# EAGLE design C64_Keyb-Test-ext (EAGLE 9.5.2)
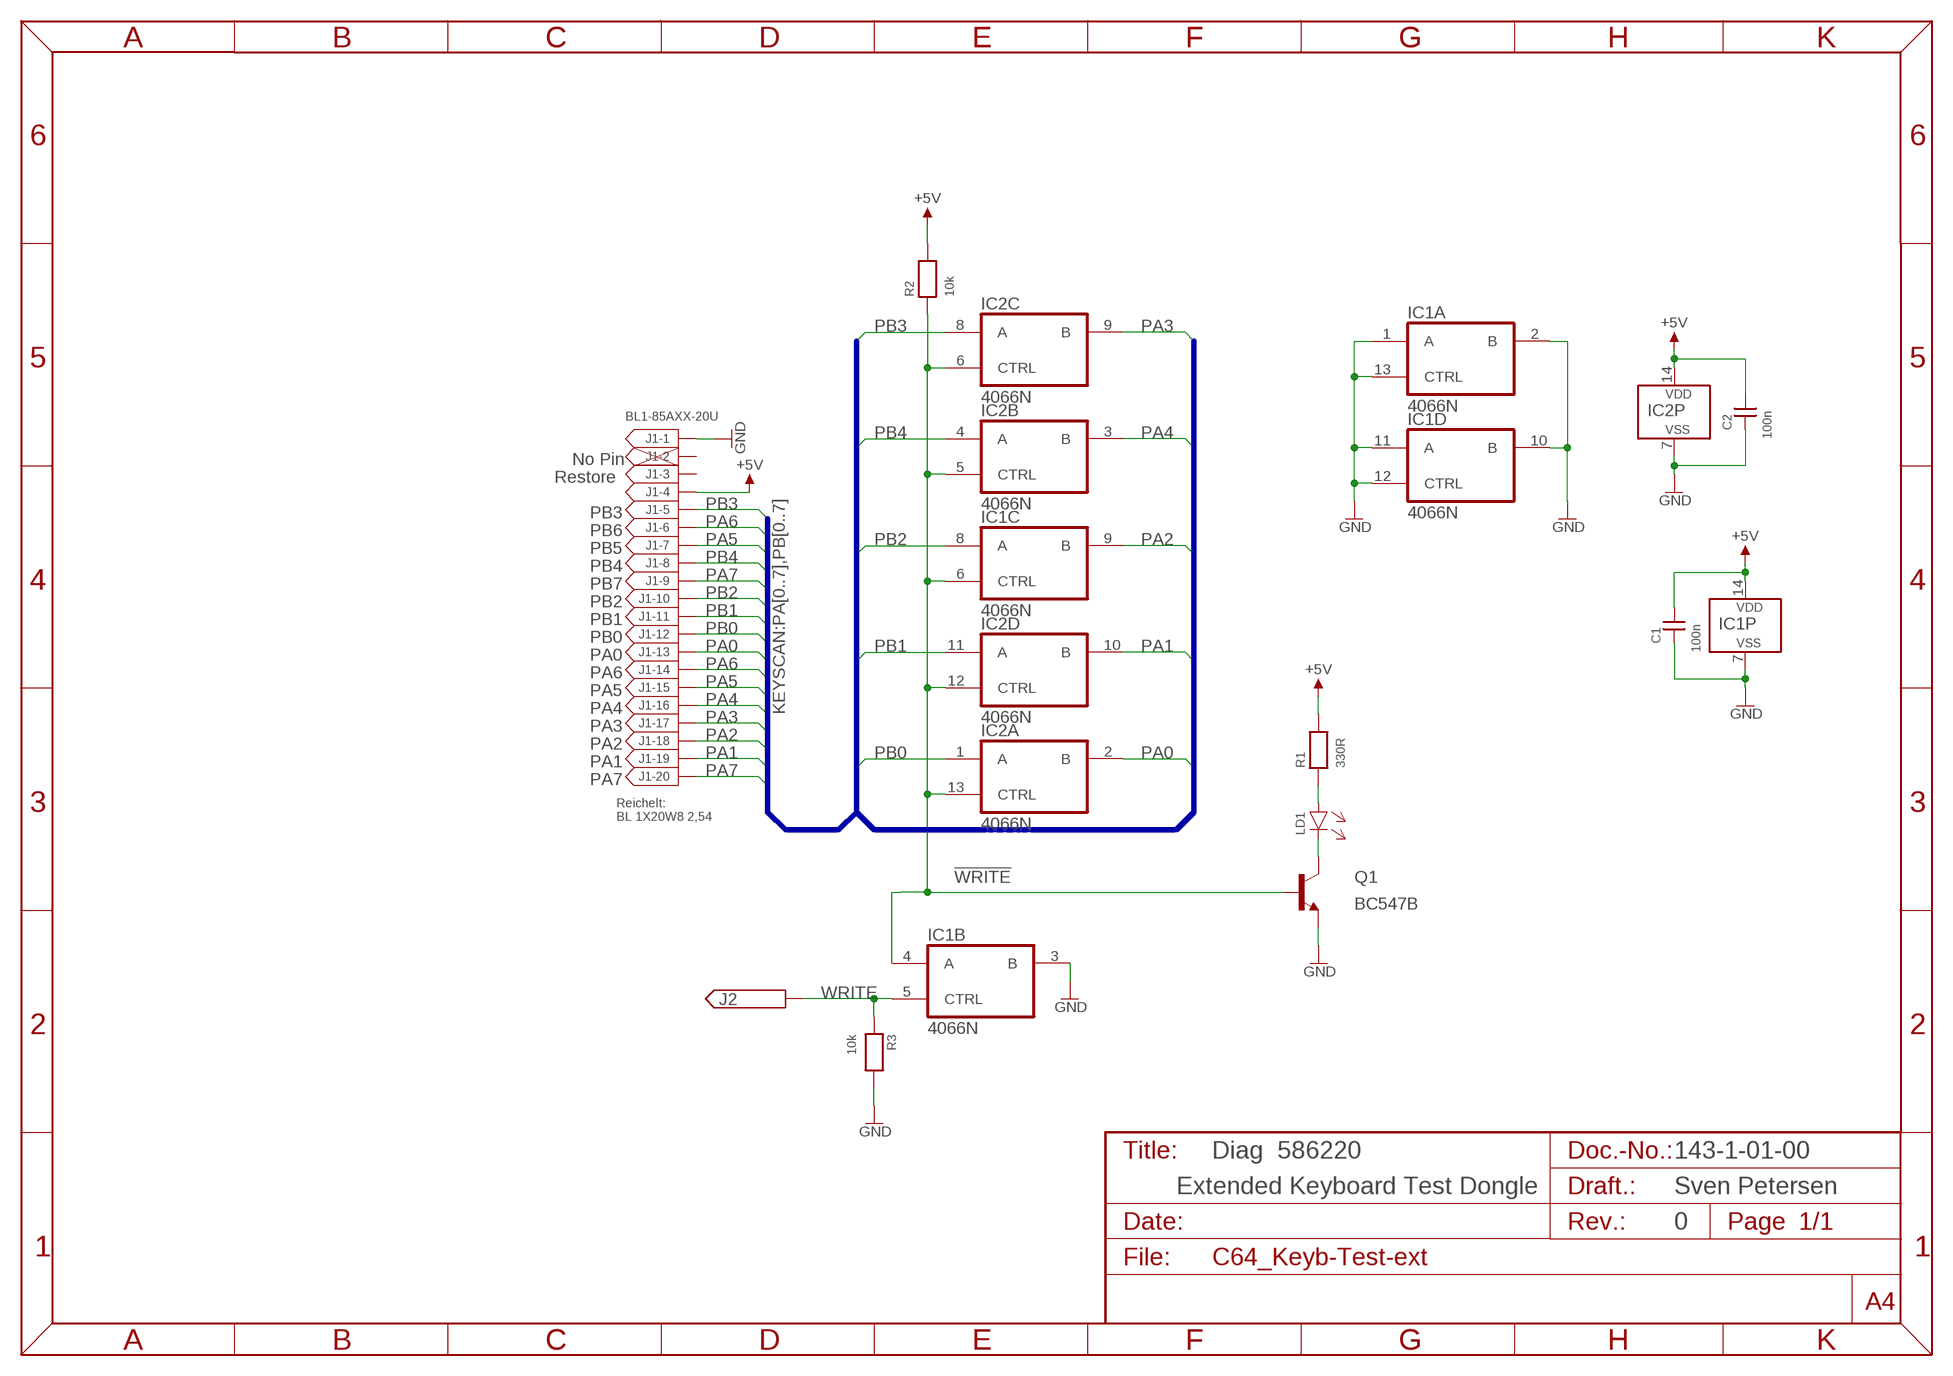
[diagram p0: schematic, sheet 1]

## Parts
C1  100n  CAP02  [C-5]
C2  100n  CAP02  [C-5]
IC1  4066N  [DIL14]
IC2  4066N  [DIL14]
J1  BL1-85AXX-20U  [BL1-85AXX-20U]
J2  PINHD-1X1  [1X01]
LD1  3MM  [3MM]
Q1  BC547B  [TO92]
R1  330R  RES04  [R-10]
R2  10k  RES04  [R-10]
R3  10k  RES04  [R-10]

## Nets
!WRITE: IC1.4(B:A) IC1.6(C:CTRL) IC2.5(B:CTRL) IC2.6(C:CTRL) IC2.12(D:CTRL) IC2.13(A:CTRL) Q1.2(B) R2.1
+5V: C1.2 C2.2 IC1.14(P:VDD) IC2.14(P:VDD) J1.4 R1.2 R2.2
GND: C1.1 C2.1 IC1.1(A:A) IC1.2(A:B) IC1.3(B:B) IC1.7(P:VSS) IC1.10(D:B) IC1.11(D:A) IC1.12(D:CTRL) IC1.13(A:CTRL) IC2.7(P:VSS) J1.1 Q1.1(E) R3.2
N$1: LD1.A R1.1
N$2: LD1.C(K) Q1.3(C)
PA0: IC2.2(A:B) J1.13
PA1: IC2.10(D:B) J1.19
PA2: IC1.9(C:B) J1.18
PA3: IC2.9(C:B) J1.17
PA4: IC2.3(B:B) J1.16
PA5: J1.7 J1.15
PA6: J1.6 J1.14
PA7: J1.9 J1.20
PB0: IC2.1(A:A) J1.12
PB1: IC2.11(D:A) J1.11
PB2: IC1.8(C:A) J1.10
PB3: IC2.8(C:A) J1.5
PB4: IC2.4(B:A) J1.8
WRITE: IC1.5(B:CTRL) J2.1 R3.1
Unconnected: J1.2 J1.3

## Buses
KEYSCAN:PA[0..7],PB[0..7]

## Notes on the sheet
- No Pin
- Restore
- PB3
- PB6
- PB5
- PB4
- PB7
- PB2
- PB1
- PB0
- PA0
- PA6
- PA5
- PA4
- PA3
- PA2
- PA1
- PA7
- Reichelt:
  BL 1X20W8 2,54
- Diag  586220 | 143-1-01-00
- Extended Keyboard Test Dongle | Sven Petersen
- 0

## Library data of the parts
C1 C2 = DISCRETE:CAP02
IC1 IC2 = 40xx:4066: Quad bilateral ANALOG SWITCH
J1 = MPE_Garry:BL1-85AXX-20U
J2 = PINHEAD:PINHD-1X1
LD1 = LED:3MM
Q1 = Transistoren:BC547*: NPN Transistor
R1-R3 = DISCRETE:RES04

## Board
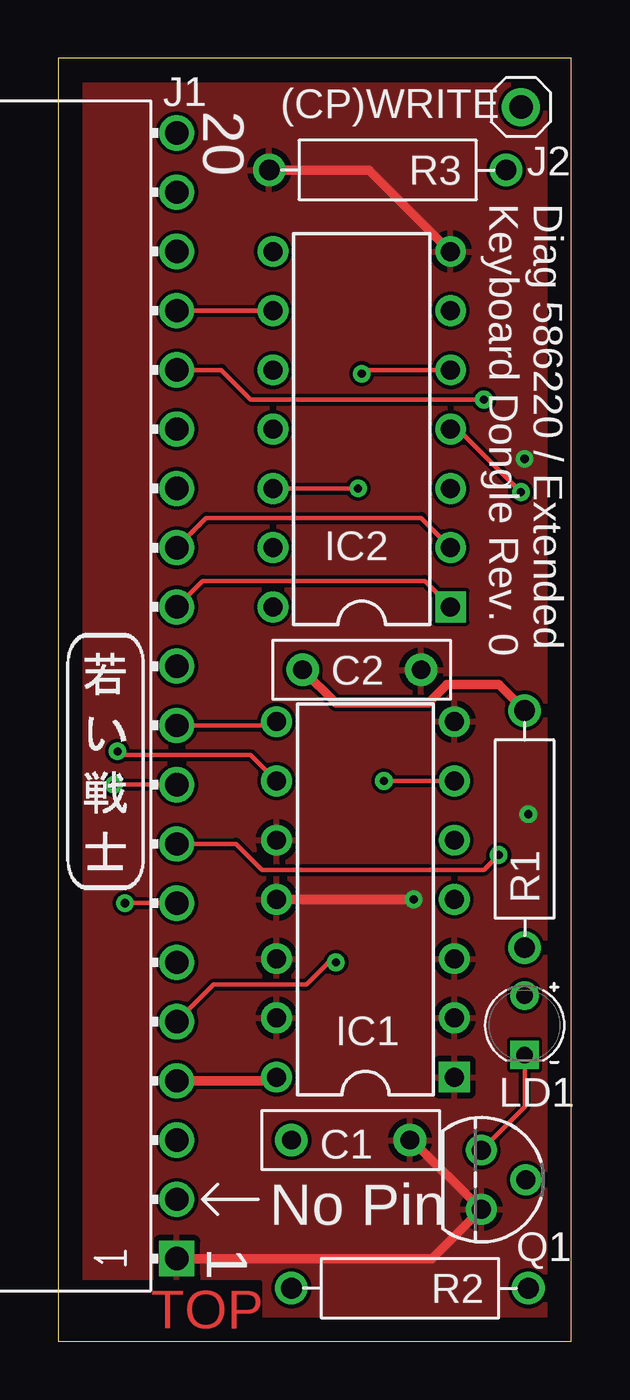
[diagram p1: board, top side]
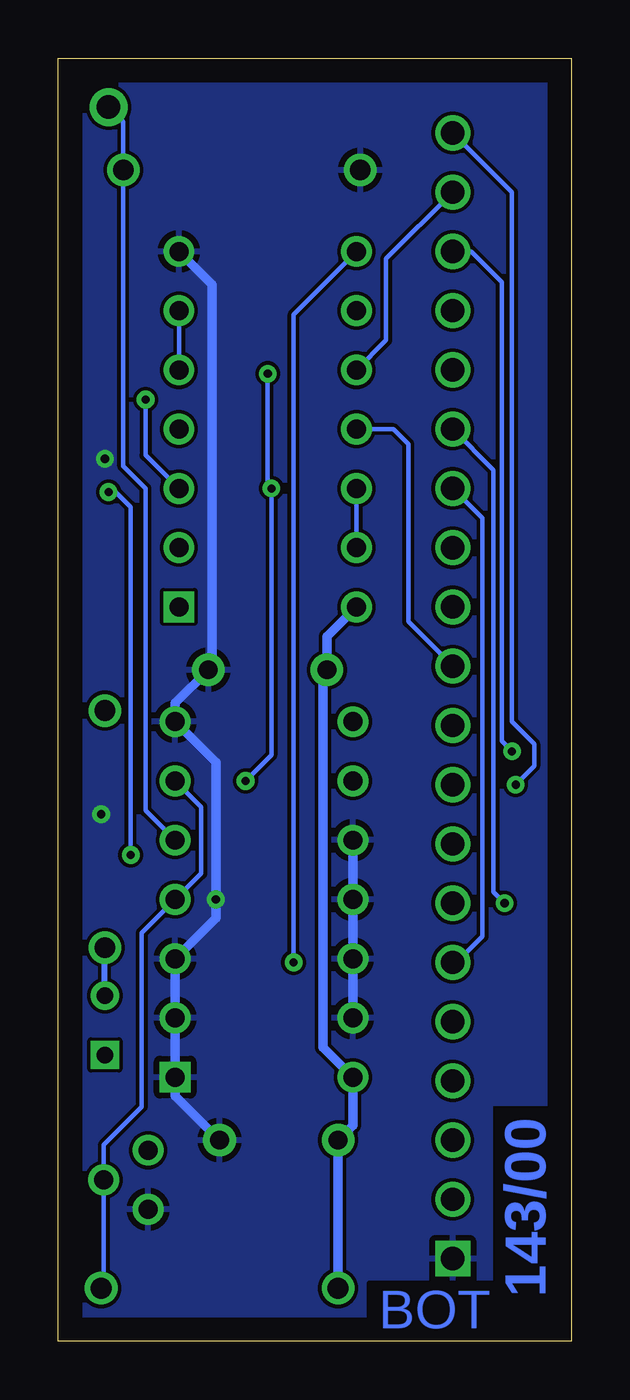
[diagram p2: board, bottom side, seen from below]

Size 22 x 55 mm. Coordinates in mm from the lower left corner, seen from the top.
Outline: 0,0 22,0 22,55 0,55 0,0
Copper layers (1*16): Top 0.035mm / dielectric 1.5mm / Bottom 0.035mm
Design rules "default *": minimum track width 6mil, minimum drill 0.35mm, track to track 6mil, track to pad 6mil, pad to pad 6mil, via to via 6mil, smd to smd 6mil, copper to edge 40mil, drill to drill 6mil, minimum pad ring 10mil, minimum via ring 8mil, stop-mask expansion 4mil, vias tented up to drill 24mil, thermal gap 10mil
bRestrict: 2 lines

### Footprints (pad centres in the part's own frame; a part is rotated, then mirrored left to right if it is on the bottom)
C-5 = drill 0.8 pad 1.397: 1 -2.54,0; 2 2.54,0
DIL14 = drill 0.813 square: 1 -7.62,-3.81 | drill 0.813: 2 -5.08,-3.81; 3 -2.54,-3.81; 4 0,-3.81; 5 2.54,-3.81; 6 5.08,-3.81; 7 7.62,-3.81; 8 7.62,3.81; 9 5.08,3.81; 10 2.54,3.81; 11 0,3.81; 12 -2.54,3.81; 13 -5.08,3.81; 14 -7.62,3.81
BL1-85AXX-20U = drill 1 square: 1 -24.13,0 | drill 1: 2 -21.59,0; 3 -19.05,0; 4 -16.51,0; 5 -13.97,0; 6 -11.43,0; 7 -8.89,0; 8 -6.35,0; 9 -3.81,0; 10 -1.27,0; 11 1.27,0; 12 3.81,0; 13 6.35,0; 14 8.89,0; 15 11.43,0; 16 13.97,0; 17 16.51,0; 18 19.05,0; 19 21.59,0; 20 24.13,0
1X01 = drill 1 pad 1.626: 1 0,0
3MM = drill 0.7: A -1.27,0 | drill 0.7 square: C 1.27,0
TO92 = drill 0.813: 1 1.27,0; 2 0,1.905; 3 -1.27,0
R-10 = drill 0.889 pad 1.397: 1 -5.08,0; 2 5.08,0

### Placement (x,y rotation side)
C1  12.54,8.62 180 top
C2  13.02,28.78 180 top
IC1  13.18,18.94 90 top
IC2  13.02,39.1 90 top
J1  5.08,27.67 90 top
J2  19.84,52.91 0 top
LD1  20,13.54 270 top
Q1  18.15,6.92 270 top
R1  20,21.95 90 top
R2  15.08,2.27 180 top
R3  14.13,50.21 180 top
U$6  [2LAYER]  3.98,0.55 0 top
U$7  [PCB-TITLE/]  0,61 0 top  (outside the outline)
U$17  [SVEN_TAG]  2.06,24.97 0 top

### Tracks (layer width: path | path; a pad name or v marks a point on that pad's centre or on a via)
!WRITE  (via drill 0.35)
  Top 0.203: IC2.12 v12.86,36.56 | v13.02,41.48 13.18,41.64 IC2.5 | v13.97,24.02 IC1.6
  Bottom 0.203: IC2.6 IC2.5 | IC2.12 IC2.13 | IC1.6 15.88,22.91 15.88,20.05 IC1.4 18.41,17.51 18.41,10.05 20.05,8.41 Q1.2 20.05,2.38 R2.1 | v13.02,41.48 13.02,36.72 v12.86,36.56 12.86,25.13 v13.97,24.02
+5V
  Top 0.406: J1.4 9.21,11.16 IC1.14 | C2.2 11.91,27.35 15.88,27.35 16.67,28.15 18.89,28.15 R1.2
  Bottom 0.406: R2.2 C1.2 9.37,9.26 IC1.14 10.64,12.59 10.64,28.62 C2.2 10.48,30.21 IC2.14
GND  (via drill 0.35)
  Top 0.406: J1.1 16.04,3.54 Q1.1 15.18,8.62 C1.1 | IC1.11 v15.24,18.94 | R3.2 13.34,50.21 IC2.7
  Bottom 0.406: IC1.10 IC1.11 IC1.12 IC1.13 | C1.1 16.99,10.53 IC1.1 IC1.2 IC1.3 15.24,18.14 v15.24,18.94 15.24,24.81 IC1.7 16.99,27.35 C2.1 15.4,28.94 15.4,45.29 IC2.7
  other vias: 20.16,22.59 20,37.83
  pour Bottom: 1.43,54.18 20.95,54.18 20.95,0.68 8.89,0.68 8.89,2.59 8.73,2.75 0.95,2.75 0.95,54.18
  pour Top: 0.95,54.18 20.95,54.18 20.95,0.68 8.89,0.68 8.89,2.59 8.73,2.75 0.95,2.75
N$1
  Bottom 0.254: LD1.A R1.1
N$2
  Top 0.203: Q1.3 20,10.05 LD1.C
PA0
  Top 0.203: J1.13 6.35,35.29 15.56,35.29 IC2.2
PA1
  Bottom 0.203: J1.19 7.94,46.4 7.94,42.91 IC2.10
PA2  (via drill 0.35)
  Top 0.203: v2.54,25.29 2.7,25.13 8.26,25.13 IC1.9
  Bottom 0.203: v2.54,25.29 2.98,25.73 2.98,45.41 4.29,46.72 J1.18
PA3
  Top 0.203: J1.17 IC2.9
PA4  (via drill 0.35)
  Top 0.203: J1.16 6.99,41.64 8.26,40.37 v18.26,40.37
  Bottom 0.203: v18.26,40.37 18.26,37.99 IC2.3
PA5  (via drill 0.35)
  Top 0.203: v2.86,18.78 J1.7
  Bottom 0.203: J1.15 3.33,37.35 3.33,19.26 v2.86,18.78
PA6
  Bottom 0.203: J1.14 3.81,35.29 3.81,17.35 4.92,16.24 J1.6
PA7  (via drill 0.35)
  Top 0.203: v2.38,23.86 J1.9
  Bottom 0.203: J1.20 2.54,49.26 2.54,26.56 1.59,25.61 1.59,24.65 v2.38,23.86
PB0
  Top 0.203: IC2.1 15.72,32.59 6.19,32.59 J1.12
PB1
  Bottom 0.203: J1.11 6.99,30.84 6.99,38.47 7.62,39.1 IC2.11
PB2
  Top 0.203: J1.10 9.21,26.4 IC1.8
PB3  (via drill 0.35)
  Top 0.203: J1.5 6.67,15.29 10.64,15.29 11.75,16.4 v11.91,16.24
  Bottom 0.203: v11.91,16.24 11.91,44.02 IC2.8
PB4  (via drill 0.35)
  Top 0.203: J1.8 7.62,21.32 8.73,20.21 18.26,20.21 v18.89,20.84 | v19.84,36.4 17.14,39.1 IC2.4
  Bottom 0.203: v18.89,20.84 18.89,35.77 19.68,36.56 v19.84,36.4
WRITE
  Bottom 0.203: J2.1 19.21,52.28 R3.1 19.21,37.51 18.26,36.56 18.26,22.75 IC1.5

### Text on the board
Bottom: 143/00
tPlace: 20 | (CP)WRITE | Diag 586220 / Extended / Keyboard Dongle Rev. 0 | No Pin | 1
Document: 143-2-01-00 | Sven Petersen / 2020 | 35µm | 2 | 0